# Altium schematic sheet Schematic.SchDoc
size A; SheetNumber: 1; SheetTotal: 1
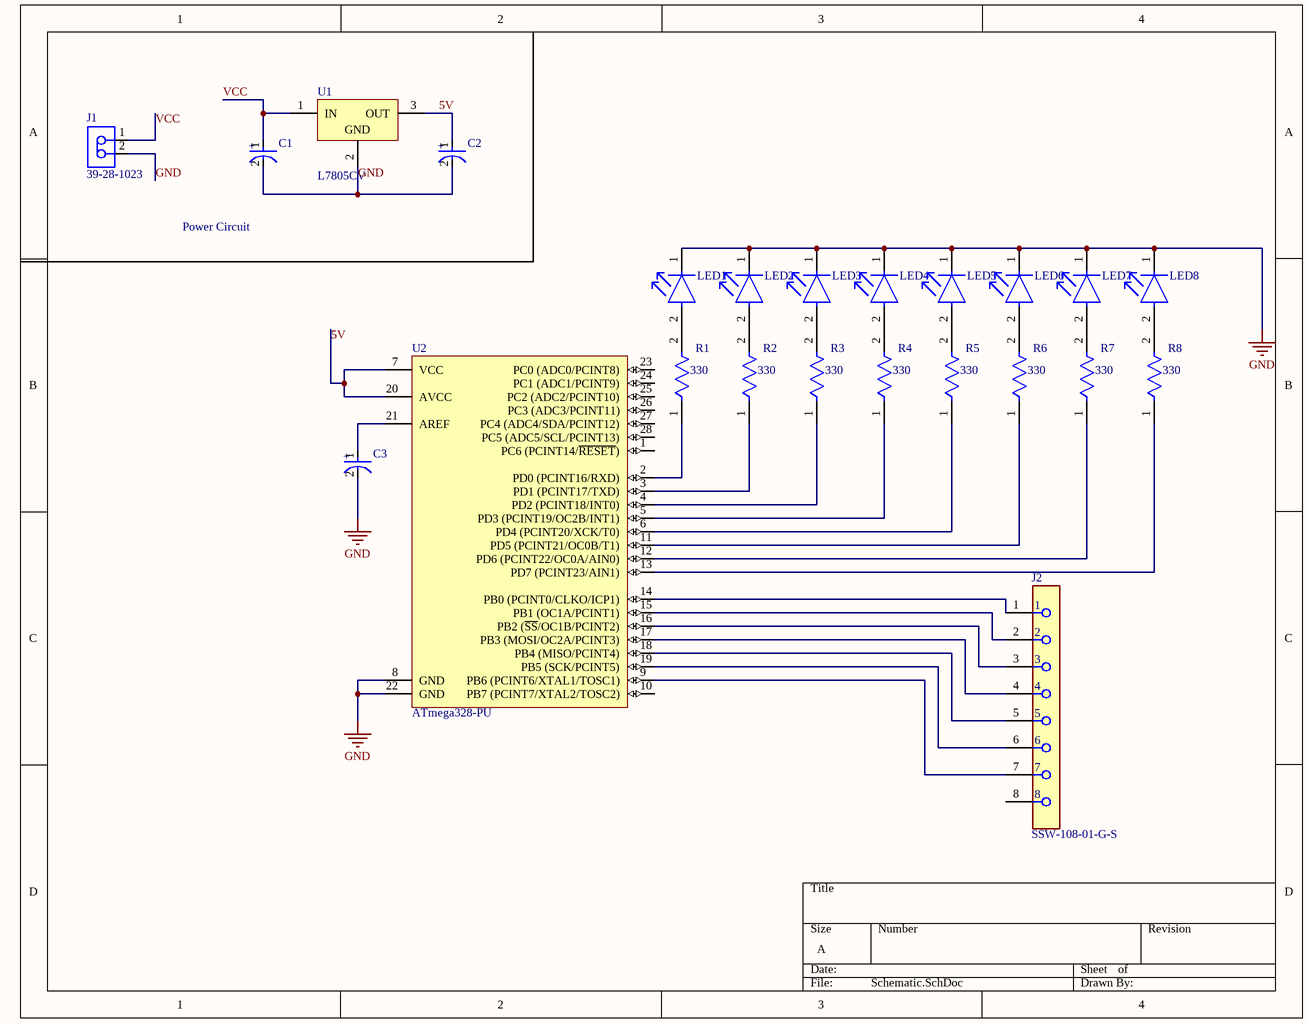
[diagram p0: Schematic.SchDoc]

## Parts
C1  300nF  [FP-EEU-FC1V221L-MFG]  (value not drawn)
C2  100nF  [FP-EEU-FC1V221L-MFG]  (value not drawn)
C3  100nF  [FP-EEU-FC1V221L-MFG]  (value not drawn)
J1  39-28-1023  [MOLX-39-28-1023-2_V]
J2  SSW-108-01-G-S  [FP-SSW-108-01-G-S-MFG]
LED1  HLMP-1719  [FP-HLMP-1719-MFG]  (value not drawn)
LED2  HLMP-1719  [FP-HLMP-1719-MFG]  (value not drawn)
LED3  HLMP-1719  [FP-HLMP-1719-MFG]  (value not drawn)
LED4  HLMP-1719  [FP-HLMP-1719-MFG]  (value not drawn)
LED5  HLMP-1719  [FP-HLMP-1719-MFG]  (value not drawn)
LED6  HLMP-1719  [FP-HLMP-1719-MFG]  (value not drawn)
LED7  HLMP-1719  [FP-HLMP-1719-MFG]  (value not drawn)
LED8  HLMP-1719  [FP-HLMP-1719-MFG]  (value not drawn)
R1  330  [FP-MFR-25-MFG]
R2  330  [FP-MFR-25-MFG]
R3  330  [FP-MFR-25-MFG]
R4  330  [FP-MFR-25-MFG]
R5  330  [FP-MFR-25-MFG]
R6  330  [FP-MFR-25-MFG]
R7  330  [FP-MFR-25-MFG]
R8  330  [FP-MFR-25-MFG]
U1  L7805CV  [TO220]
U2  ATmega328-PU  [28P3]

## Nets
GND: C1.2(A) C2.2(A) C3.2(A) J1.2 LED1.1(C) LED2.1(C) LED3.1(C) LED4.1(C) LED5.1(C) LED6.1(C) LED7.1(C) LED8.1(C) U1.2(GND) U2.8(GND) U2.22(GND)
5V: C2.1(C) U1.3(OUT) U2.7(VCC) U2.20(AVCC)
VCC: C1.1(C) J1.1 U1.1(IN)
NetC3_1: C3.1(C) U2.21(AREF)
NetJ2_1: J2.1 U2.14(PB0_(PCINT0/CLKO/ICP1))
NetJ2_2: J2.2 U2.15(PB1_(OC1A/PCINT1))
NetJ2_3: J2.3 U2.16(PB2_(~{SS}/OC1B/PCINT2))
NetJ2_4: J2.4 U2.17(PB3_(MOSI/OC2A/PCINT3))
NetJ2_5: J2.5 U2.18(PB4_(MISO/PCINT4))
NetJ2_6: J2.6 U2.19(PB5_(SCK/PCINT5))
NetJ2_7: J2.7 U2.9(PB6_(PCINT6/XTAL1/TOSC1))
NetLED1_2: LED1.2(A) R1.2
NetLED2_2: LED2.2(A) R2.2
NetLED3_2: LED3.2(A) R3.2
NetLED4_2: LED4.2(A) R4.2
NetLED5_2: LED5.2(A) R5.2
NetLED6_2: LED6.2(A) R6.2
NetLED7_2: LED7.2(A) R7.2
NetLED8_2: LED8.2(A) R8.2
NetR1_1: R1.1 U2.2(PD0_(PCINT16/RXD))
NetR2_1: R2.1 U2.3(PD1_(PCINT17/TXD))
NetR3_1: R3.1 U2.4(PD2_(PCINT18/INT0))
NetR4_1: R4.1 U2.5(PD3_(PCINT19/OC2B/INT1))
NetR5_1: R5.1 U2.6(PD4_(PCINT20/XCK/T0))
NetR6_1: R6.1 U2.11(PD5_(PCINT21/OC0B/T1))
NetR7_1: R7.1 U2.12(PD6_(PCINT22/OC0A/AIN0))
NetR8_1: R8.1 U2.13(PD7_(PCINT23/AIN1))

Not connected (* = marked no-connect by the designer): J2 8; U2 1(PC6_(PCINT14/~{RESET})) 10(PB7_(PCINT7/XTAL2/TOSC2)) 23(PC0_(ADC0/PCINT8)) 24(PC1_(ADC1/PCINT9)) 25(PC2_(ADC2/PCINT10)) 26(PC3_(ADC3/PCINT11)) 27(PC4_(ADC4/SDA/PCINT12)) 28(PC5_(ADC5/SCL/PCINT13))

## Notes on the sheet
- Power Circuit
- (in symbol CMP-05427-000010-1) +

## Library data of the parts
C1-C3 = CMP-05427-000010-1: CAP ALUM 220UF 20% 35V RADIAL; Manufacturer: Panasonic Electronic Components; Manufacturer Part Number: EEU-FC1V221L; Material: Aluminum; Leakage Current: 77uA; Esr: 0.085Ω; Life: 2000Hours; Automotive Grade: Grade 2; Dissipation Factor: 12%; Ripple Current: 730mA; Octopart: https://octopart.com/eeu-fc1v221l-panasonic-39478519; ComponentLink2URL: https://industrial.panasonic.com/cdbs/www-data/pdf/RDF0000/ABA0000C1209.pdf; Package: 0; Height: 16.5mm; Category: Cap; Value: 220uF; ComponentLink2Description: Datasheet; Lead Free: Yes; Device Class L2: Capacitors; Temperature Range High: +105°C; Mouser Description: Capacitor; Aluminum Electrolytic; Fc Radial Elec Cap 220uF 35V; Temperature: -55°C to +105°C; Digikey Description: CAP ALUM 220UF 20% 35V RADIAL; Device Class L3: Aluminum Electrolytic Capacitors; Device Class L1: Passive Components; Automotive: Yes; RoHS: TRUE; Temperature Range Low: -55°C; Capacitance: 220uF; Voltage Rating: 35V; Tolerance: 20%
J1 = CMP-2000-05244-1: Female Header, Pitch 4.2 mm, 1 x 2 Position, Height 12.8 mm, Tail Length 3.5 mm, -40 to 105 degC, RoHS; Manufacturer: Molex; No. of Poles: 2; Working Voltage: 250V; No. of Rows: 1; Current Rating: 13A; Contact Termination: Solder; No. of Contacts: 4; Connector Body Material: –; Voltage Rating V AC: 600V; Mounting Orientation: Straight; Pitch Spacing: 4.2mm; Connector Mounting: PCB; Connector Type: RectangularPower; Manufacturer URL: http://www.molex.com/; Contact Plating: Tin; Gender: Header; Lead Spacing: 4.2mm; Colour: Clear; Series: Mini-FitJr; No. of Ways: 2; MSL: –; Connector Insert Type: Header; Flammability Rating: UL94V-2; Datasheet URL: https://datasheet.ciiva.com/11746/0900766b80460d9e-11746456.pdf; Termination Method: Solder; Mounting Type: PCBoard; Contact Material: Brass; Datasheet Version: Rev. F, 05/2004; SVHC: –; Connector Mounting Orientation: PCB; Contact Gender: –
J2 = CMP-1272-00001-2: CONN RCPT 8POS 0.1 GOLD PCB; Pitch: 2.54mm; Number of Positions: 8; Max Current Rating: 6.9A; Gender: Receptacle; Max Voltage Rating (AC): 550V; Contact Resistance: 10mR; Mating Cycles: 100; Connector Type: Socket; Series: SSW; Length: 20.83mm; Packaging: Bulk; Contact Material: Bronze; Color: Black; Housing Material: Polymer; Number of Rows: 1; REACH SVHC: No SVHC; Lead Free: Lead Free; Termination: Solder; Max Operating Temperature: 125°C; Depth: 2.41mm; Number of Contacts: 8; Min Operating Temperature: -55°C; Housing Color: Black; RoHS Compliant: Yes; Contact Plating: Gold; Radiation Hardening: No; Contact Type: Female Socket; Orientation: Vertical; Voltage Rating: 550V; Current Rating: 6.9A
LED1-LED8 = CMP-2000-06410-2: LED YELLOW DIFFUSED T-1 T/H; Manufacturer: Broadcom; Wavelength: 585nm; Led Orientation: Straight; Luminous Intensity: 2.1mcd; Forward Voltage: 1.8V; Viewing Angle: 50°; Reverse Voltage: 5V; Power Dissipation: 17.5mW; Forward Current: 2mA; Lead Free: Yes; Automotive: No; Device Class L1: Optoelectronics; Mouser Description: Standard LEDs - Through Hole Yellow Diffused 585nm 2.1mcd; Digikey Description: LED YELLOW DIFFUSED T-1 T/H; Temperature: -40°C to +100°C; Temperature Range High: +100°C; Package: 0; Category: Diode; Colour: Yellow; Device Class L2: LEDs; ComponentLink2Description: Datasheet; ComponentLink2URL: https://docs.broadcom.com/docs/AV02-1557EN; Temperature Range Low: -40°C; Device Class L3: unset; Octopart: https://octopart.com/hlmp-1719-broadcom-71130405; RoHS: TRUE; Manufacturer Part Number: HLMP-1719
R1-R8 = CMP-03413-000001-1: RES 1.18K OHM 1/4W 1% AXIAL; Manufacturer: Yageo; Manufacturer Part Number: MFR-25FBF52-1K18; Value: 1.18kΩ; Temperature Coefficient: 100ppm/°C; Power Rating: 0.25W; Voltage Rating: 250V; Temperature: -55°C to +155°C; Automotive: No; Temperature Range High: +155°C; Mouser Description: Metal Film Resistors 1.18K OHM 1/4W 1%; Digikey Description: RES 1.18K OHM 1/4W 1% AXIAL; Lead Free: Yes; Tolerance: 1%; ComponentLink2Description: Datasheet; ComponentLink2URL: https://www.yageo.com/upload/media/product/products/datasheet/lr/Yageo_LR_MFR_1.pdf; Temperature Range Low: -55°C; Package: MFR-25; Ipc Land Pattern Name: RESAD1000W75L680D260; Composition: Metal Film; Category: Res; Octopart: https://octopart.com/mfr-25fbf52-1k18-yageo-56251681; Series: MFR; Device Class L2: Resistors; Height: 2.6mm; Resistance: 1.18kΩ; Device Class L3: Through-Hole Resistors; RoHS: TRUE; Device Class L1: Passive Components
U1 = CMP-0244-00483-1: Positive Voltage Regulator, 5V, 3-Pin TO-220; PackageDescription: TO, Thru-Hole, Vertical, Heatsink Mounted; 3 In-Line Leads; Pitch 2.54 mm; ComponentLink2Description: Datasheet; PackageReference: TO220; ComponentLink3URL: http://www.st.com/internet/com/TECHNICAL_RESOURCES/TECHNICAL_LITERATURE/PACKAGE_INFORMATION/CD00004649.pdf; DatasheetVersion: 16/11/2011; ComponentLink1Description: Manufacturer URL; ComponentLink1URL: http://www.st.com; PackageVersion: ver3.0; ComponentLink3Description: Package Specification; ComponentLink2URL: http://www.st.com/internet/com/TECHNICAL_RESOURCES/TECHNICAL_LITERATURE/DATASHEET/CD00000444.pdf
U2 = CMP-0095-00015-2: 8-bit AVR Microcontroller, 32KB Flash, 1KB EEPROM, 2KB SRAM, 28-pin PDIP, Industrial Grade (-40°C to 85°C); ComponentLink3Description: ATmega48A/48PA/88A/88PA/168A/168PA/328/328P Summary; RevisionNote: DatasheetVersion updated. URLs added.; DatasheetVersion: revD, May-2011; ComponentLink1URL: http://www.atmel.com/; PackageVersion: revB, Sep-2001; PackageDescription: 28-lead (0.300"/7.62mm Wide) Plastic Dual Inline Package (PDIP); PackageReference: 28P3; ComponentLink1Description: Manufacturer URL; ComponentLink2Description: ATmega48A/48PA/88A/88PA/168A/168PA/328/328P Datasheet; ComponentLink3URL: http://www.atmel.com/dyn/resources/prod_documents/8271S.pdf; ComponentLink2URL: http://www.atmel.com/dyn/resources/prod_documents/8271.pdf